# EAGLE schematic PCB Capacitor (EAGLE 9.6.2)
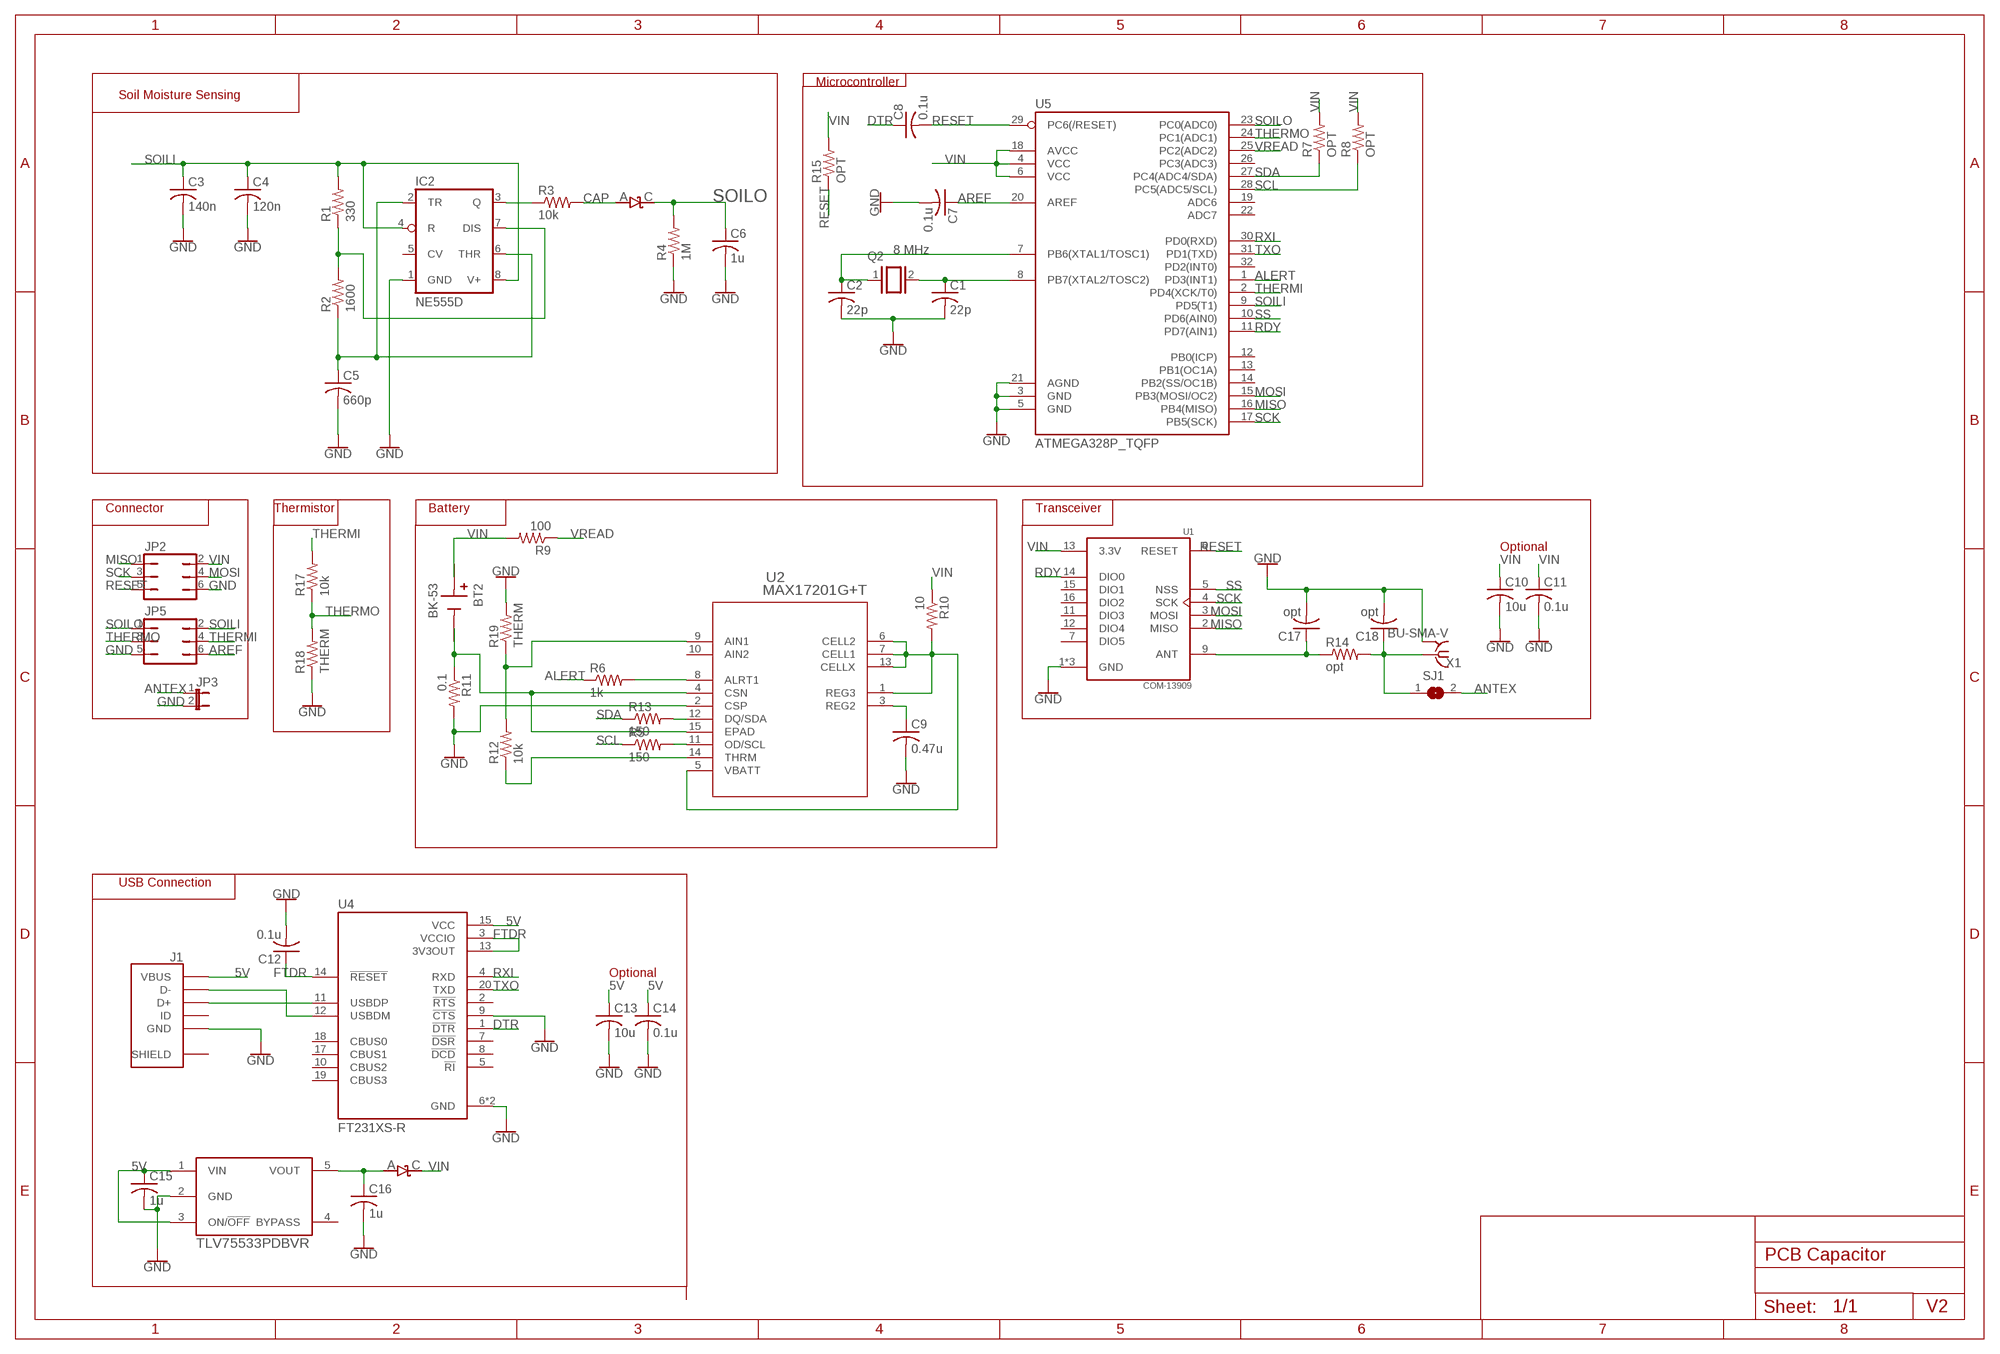
[diagram p0: schematic, sheet 1]

## Parts
BT2  BK-53  [BAT_BK-53]
C1  22p  C-USC0805  [C0805]
C2  22p  C-USC0805  [C0805]
C3  140n  C-USC0805  [C0805]
C4  120n  C-USC0805  [C0805]
C5  660p  C-USC0805  [C0805]
C6  1u  C-USC0805  [C0805]
C7  0.1u  C-USC0805  [C0805]
C8  0.1u  C-USC0805  [C0805]
C9  0.47u  C-USC0805  [C0805]
C10  10u  C-USC0805  [C0805]
C11  0.1u  C-USC0805  [C0805]
C12  0.1u  C-USC0805  [C0805]
C13  10u  C-USC0805  [C0805]
C14  0.1u  C-USC0805  [C0805]
C15  1u  C-USC0805  [C0805]
C16  1u  C-USC0805  [C0805]
C17  opt  C-USC0805  [C0805]
C18  opt  C-USC0805  [C0805]
D1  DIODE_SCHOTTKY_CMMSH2-40  [SOD-123]
D11  DIODE_SCHOTTKY_CMMSH2-40  [SOD-123]
IC2  NE555D  [SO08]
J1  USB3076-XX-X_REVC  [GCT_USB3076-XX-X_REVC]
JP2  JP3Q  [JP3Q]
JP3  JP1E  [JP1]
JP5  JP3Q  [JP3Q]
Q2  8 MHz  XTAL/S  [QS]
R1  330  R-US_R0603  [R0603]
R2  1600  R-US_R0603  [R0603]
R3  10k  R-US_R0603  [R0603]
R4  1M  R-US_R0603  [R0603]
R5  150  R-US_R0603  [R0603]
R6  1k  R-US_R0603  [R0603]
R7  OPT  R-US_R0603  [R0603]
R8  OPT  R-US_R0603  [R0603]
R9  100  R-US_R0603  [R0603]
R10  10  R-US_R0603  [R0603]
R11  0.1  R-US_R0603  [R0603]
R12  10k  R-US_R0603  [R0603]
R13  150  R-US_R0603  [R0603]
R14  opt  R-US_R0603  [R0603]
R15  OPT  R-US_R0603  [R0603]
R17  10k  R-US_R0603  [R0603]
R18  THERM  R-US_R0603  [R0603]
R19  THERM  R-US_R0603  [R0603]
SJ1  SJ  [SJ]
TLV75533PDBVR  LP2985-33DBVR  [SOT-23-5]
U1  COM-13909  [MOD_COM-13909]
U2  MAX17201G+T  [21-0137_T1433-2C_MXM]
U4  FT231XS-R  [SOP63P599X175-20N]
U5  ATMEGA328P_TQFP  [TQFP32-08]
X1  BU-SMA-V  [BU-SMA-V]

## Nets
5V [Power]: C13.1 C14.1 C15.1 J1.1(VBUS) TLV75533PDBVR.1(VIN) TLV75533PDBVR.3(ON/!OFF!) U4.15(VCC)
ALERT: R6.1 U5.1(PD3(INT1))
ANTEX: JP3.1 SJ1.2
AREF: C7.1 JP5.6 U5.20(AREF)
CAP: D11.A R3.2
DTR: C8.1 U4.1(!DTR)
FTDR: C12.1 U4.3(VCCIO) U4.13(3V3OUT) U4.14(!RESET)
GND [Power]: C1.2 C2.2 C3.2 C4.2 C5.2 C6.2 C7.2 C9.2 C10.2 C11.2 C12.2 C13.2 C14.2 C15.2 C16.2 C17.2 C18.2 IC2.1(GND) J1.5(GND) JP2.6 JP3.2 JP5.5 R4.1 R11.2 R18.1 R19.2 TLV75533PDBVR.2(GND) U1.1(GND) U1.8(GND) U1.10(GND) U2.2(CSP) U4.6(GND) U4.9(!CTS) U4.16(GND) U5.3(GND) U5.5(GND) U5.21(AGND) X1.2 X1.3 X1.4 X1.5
MISO: JP2.1 U1.2(MISO) U5.16(PB4(MISO))
MOSI: JP2.4 U1.3(MOSI) U5.15(PB3(MOSI/OC2))
N$1: R12.1 U2.14(THRM)
N$2: IC2.7(DIS) R1.1 R2.2
N$3: C5.1 IC2.2(TR) IC2.6(THR) R2.1
N$4 [Power]: BT2.1-(-) BT2.2-(-) R11.1 U2.4(CSN) U2.15(EPAD)
N$5: C9.1 U2.3(REG2)
N$6: C1.1 Q2.2 U5.8(PB7(XTAL2/TOSC2))
N$7: C2.1 Q2.1 U5.7(PB6(XTAL1/TOSC1))
N$8: J1.2(D-) U4.12(USBDM)
N$9: IC2.3(Q) R3.1
N$10: J1.3(D+) U4.11(USBDP)
N$12 [Power]: R10.2 U2.1(REG3) U2.5(VBATT) U2.6(CELL2) U2.7(CELL1) U2.13(CELLX)
N$13: R12.2 R19.1 U2.9(AIN1)
N$14: R6.2 U2.8(ALRT1)
N$15: R13.2 U2.12(DQ/SDA)
N$16: R5.2 U2.11(OD/SCL)
N$17 [Power]: C16.1 D1.A TLV75533PDBVR.5(VOUT)
N$19 [Power]: C18.1 R14.2 SJ1.1 X1.1
N$24 [Power]: C17.1 R14.1 U1.9(ANT)
RDY: U1.14(DIO0) U5.11(PD7(AIN1))
RESET: C8.2 JP2.5 R15.1 U1.6(RESET) U5.29(PC6(/RESET))
RXI: U4.4(RXD) U5.30(PD0(RXD))
SCK: JP2.3 U1.4(SCK) U5.17(PB5(SCK))
SCL: R5.1 R8.1 U5.28(PC5(ADC5/SCL))
SDA: R7.1 R13.1 U5.27(PC4(ADC4/SDA))
SOILI: C3.1 C4.1 IC2.4(R) IC2.8(V+) JP5.2 R1.2 U5.9(PD5(T1))
SOILO: C6.1 D11.C JP5.1 R4.2 U5.23(PC0(ADC0))
SS: U1.5(NSS) U5.10(PD6(AIN0))
THERMI: JP5.4 R17.2 U5.2(PD4(XCK/T0))
THERMO: JP5.3 R17.1 R18.2 U5.24(PC1(ADC1))
TXO: U4.20(TXD) U5.31(PD1(TXD))
VIN [Power]: BT2.1+(+) BT2.2+(+) C10.1 C11.1 D1.C JP2.2 R7.2 R8.2 R9.2 R10.1 R15.2 U1.13(3.3V) U5.4(VCC) U5.6(VCC) U5.18(AVCC)
VREAD: R9.1 U5.25(PC2(ADC2))
Unconnected: IC2.5(CV) J1.4(ID) TLV75533PDBVR.4(BYPASS) U1.7(DIO5) U1.11(DIO3) U1.12(DIO4) U1.15(DIO1) U1.16(DIO2) U2.10(AIN2) U4.2(!RTS) U4.5(!RI) U4.7(!DSR) U4.8(!DCD) U4.10(CBUS2) U4.17(CBUS1) U4.18(CBUS0) U4.19(CBUS3) U5.12(PB0(ICP)) U5.13(PB1(OC1A)) U5.14(PB2(SS/OC1B)) U5.19(ADC6) U5.22(ADC7) U5.26(PC3(ADC3)) U5.32(PD2(INT0))

## Notes on the sheet
- Microcontroller
- Soil Moisture Sensing
- Connector | Thermistor | Battery | Transceiver
- Optional
- USB Connection
- Optional
- V2

## Power pins joined to a net without a drawn wire
SHIELD: J1.6(SHIELD) J1.7(SHIELD) J1.8(SHIELD) J1.9(SHIELD) J1.10(SHIELD) J1.11(SHIELD)

## Library data of the parts
BT2 = BK-53:BK-53: Battery Contact Clip AA 1 Cell SMD (SMT) Tab; DESCRIPTION: Battery Contact Clip AA 1 Cell SMD (SMT) Tab; DIGI-KEY_PART_NUMBER: BK-53-TR-ND; MF: MPD (Memory Protection Devices); MP: BK-53; PACKAGE: None; PURCHASE-URL: https://pricing.snapeda.com/search/part/BK-53/?ref=eda
C1-C18 = rcl:C-US: CAPACITOR, American symbol; SPICEPREFIX: C
D1 D11 = diode:DIODE_SCHOTTKY_CMMSH2-40
IC2 = linear:*555: TIMER
J1 = USB3076-XX-X_REVC:USB3076-XX-X_REVC: Micro USB Receptacle, Type B, SMT, Horizontal, Bottom Mount w/out Peg, w/out Shell Stakes, w/out Mating Face Lead-In; AVAILABILITY: Unavailable; DESCRIPTION: USB - micro B USB 2.0 Receptacle Connector 5 Position Surface Mount, Right Angle; Through Hole, 2.35mm profile, 5 Pins, Horizontal, Bottom mount; MF: Global Connector Technology; MP: USB3076-30-A; PACKAGE: None; PRICE: None
JP2 JP5 = jumper:JP3Q: JUMPER
JP3 = jumper:JP1E: JUMPER
Q2 = special:XTAL/S: CRYSTAL
R1-R15 R17-R19 = rcl:R-US_: RESISTOR, American symbol; SPICEPREFIX: R
SJ1 = jumper:SJ: SMD solder JUMPER
TLV75533PDBVR = IC:LP2985-33DBVR: IC REG LINEAR 3.3V 150MA SOT23-5 Manufacturer's datasheet <http://www.ti.com/lit/ds/symlink/lp2985.pdf>; CREATED_BY: PCBLayout.com; DIGIKEY_PART_NUMBER: 296-18476-2-ND; MANUFACTURER: Texas Instruments; MPN: LP2985-33DBVR; PACKAGE: SOT-23-5
U1 = COM-13909:COM-13909: Rfm69hcw Wireless Transceiver 91; DESCRIPTION: General ISM < 1GHz Transceiver Module 915MHz Surface Mount; DIGI-KEY_PART_NUMBER: 1568-1394-ND; MF: SparkFun Electronics; MP: COM-13909; PACKAGE: None; PURCHASE-URL: https://pricing.snapeda.com/search/part/COM-13909/?ref=eda
U2 = MAX17201G+T:MAX17201G+T; BUILT_BY: UL_Team_Molly; COPYRIGHT: Copyright (C) 2018 Accelerated Designs. All rights reserved; MANUFACTURER_PART_NUMBER: MAX17201G+T; REVISION: 1; SOURCELIBRARY: Maxim_2018-10-24; VENDOR: Maxim Integrated Products
U4 = FT231XS-R:FT231XS-R: USB Full Speed to Full Handshake UART with USB Charger Detection; DESCRIPTION: USB Bridge, USB to UART USB 2.0 UART Interface 20-SSOP; DIGI-KEY_PART_NUMBER: 768-1129-1-ND; MF: FTDI,; MP: FT231XS-R; PACKAGE: SSOP-20 FTDI; PURCHASE-URL: https://pricing.snapeda.com/search/part/FT231XS-R/?ref=eda
U5 = SparkFun-IC-Microcontroller:ATMEGA328P_TQFP: Popular 328P in QFP Storefront component: ATmega328 - TQFP <https://www.sparkfun.com/products/13448> (COM-13448) Datasheet <http://www.sparkfun.com/datasheets/Components/SMD/ATMega328.pdf> SparkFun Products SparkFun RedBoard - Programmed with Arduino <https://www.sparkfun.com/products/12757> (DEV-12757) Arduino Pro Mini 328 - 5V/16MHz <https://www.sparkfun.com/products/11113> (DEV-11113) Arduino Pro Mini 328 - 3.3V/8MHz <https://www.sparkfun.com/products/11114> (DEV-11114) SparkFun OpenLog <https://www.sparkfun.com/products/13712> (DEV-13712) SparkFun MicroView - OLED Arduino Module <https://www.sparkfun.com/products/12923> (DEV-12923) SparkFun Digital Sandbox <https://www.sparkfun.com/products/12651> (DEV-12651) SparkFun PicoBoard <https://www.sparkfun.com/products/11888> (WIG-11888) Arduino Fio <https://www.sparkfun.com/products/10116> (DEV-10116) LilyPad Arduino 328 Main Board <https://www.sparkfun.com/products/13342> (DEV-13342) SparkFun RedStick <https://www.sparkfun.com/products/13741> (DEV-13741) LilyPad MP3 <https://www.sparkfun.com/products/11013> (DEV-11013) LilyPad Arduino SimpleSnap <https://www.sparkfun.com/products/10941> (DEV-10941) SparkFun Stepoko <https://www.sparkfun.com/products/13899> (ROB-13899) SparkFun Geiger Counter <https://www.sparkfun.com/products/11345> (SEN-11345) SparkFun EL Sequencer <https://www.sparkfun.com/products/12781> (COM-12781) Arduino Pro 328 - 5V/16MHz <https://www.sparkfun.com/products/10915> (DEV-10915) CryptoCape <https://www.sparkfun.com/products/12773> (DEV-12773) SparkFun IR Thermometer Evaluation Board - MLX90614 <https://www.sparkfun.com/products/10740> (SEN-10740) SparkFun RedBot Mainboard <https://www.sparkfun.com/products/12097> (ROB-12097) Arduino Pro 328 - 3.3V/8MHz <https://www.sparkfun.com/products/10914> (DEV-10914) SparkFun Block for Intel® Edison - Arduino <https://www.sparkfun.com/products/13036> (DEV-13036) SparkFun Simon Says - Surface Mount Soldering Kit <https://www.sparkfun.com/products/10935> (KIT-10935) SparkFun 7-Segment Serial Display - Red <https://www.sparkfun.com/products/11441> (COM-11441) SparkFun 7-Segment Serial Display - White <https://www.sparkfun.com/products/11629> (COM-11629) SparkFun 7-Segment Serial Display - Yellow <https://www.sparkfun.com/products/11443> (COM-11443) SparkFun 7-Segment Serial Display - Kelly Green <https://www.sparkfun.com/products/11440> (COM-11440) SparkFun 7-Segment Serial Display - Blue <https://www.sparkfun.com/products/11442> (COM-11442) SparkFun OpenSegment Serial Display - 20mm (Blue) <https://www.sparkfun.com/products/11647> (COM-11647) SparkFun OpenSegment Serial Display - 20mm (Green) <https://www.sparkfun.com/products/11646> (COM-11646) SparkFun OpenSegment Serial Display - 20mm (White) <https://www.sparkfun.com/products/11648> (COM-11648) SparkFun OpenSegment Serial Display - 20mm (Red) <https://www.sparkfun.com/products/11644> (COM-11644) SparkFun OpenSegment Serial Display - 20mm (Yellow) <https://www.sparkfun.com/products/11645> (COM-11645) SparkFun OpenSegment Shield <https://www.sparkfun.com/products/13190> (DEV-13190); PROD_ID: IC-09069
X1 = con-coax:BU-SMA-V: FEMALE SMA CONNECTOR Radiall distributor RS 112-3794; OC_FARNELL: unknown; OC_NEWARK: unknown

## Net classes
0 default: width 0.152 mm
1 Power: width 0.305 mm